# EAGLE design daughterboard (EAGLE 9.6.2)
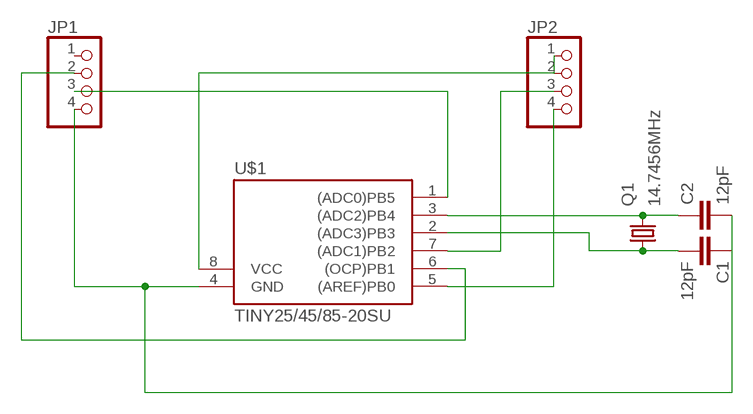
[diagram p0: schematic, sheet 1]

## Parts
C1  12pF  C-EUC0805  [C0805]
C2  12pF  C-EUC0805  [C0805]
JP1  PINHD-1X4  [1X04]
JP2  PINHD-1X4  [1X04]
Q1  14.7456MHz  KX-7  [3.2X2.5_KX-7]
U$1  TINY25/45/85-20SU  [SOIC8]

## Nets
N$1: JP2.1 JP2.2 U$1.8(VCC)
N$2: JP2.3 U$1.7((ADC1)PB2)
N$3: JP2.4 U$1.5((AREF)PB0)
N$4: C1.1 C2.2 JP1.4 U$1.4(GND)
N$5: JP1.3 U$1.1((ADC0)PB5)
N$6: JP1.2 U$1.6((OCP)PB1)
N$7: C2.1 Q1.3 U$1.3((ADC2)PB4)
N$8: C1.2 Q1.1 U$1.2((ADC3)PB3)
Unconnected: JP1.1

## Library data of the parts
C1 C2 = resistor:C-EU: CAPACITOR, European symbol
JP1 JP2 = pinhead:PINHD-1X4: PIN HEADER
Q1 = crystal-geyer_V1_0:KX: Quartz Crystals (MHz) SMD: KX - Serie Model Size l/w/h [mm] Frequency Range Frequency Stability Temp. Range [°C] Load Capacitance AECQ 200 availabel Datasheet KX-4 KX-5 KX-6 KX-7 KX-9A KX-9B KX-12A KX-12B KX-13 KX-20 KX-K KX-KS 1.6/1.2/0.3 2.0/1.6/0.45 2.5/2.0/0.55 3.2/2.5/0.8 5.0/3.2/1.0 5.0/3.2/1.1 6.0/3.5/1.1 6.0/3.5/1.0 7.0/5.0 /1.3 11.6/5.5/1.6 12.3/4.5/4.2 12.3/4.5/3.2 24.0 ~ 80.0 MHz 16.0 ~ 80.0 MHz 12.0 ~ 80.0 MHz 8.0 ~ 60.0 MHz 7,68 ~ 300,0 MHz 8,0 ~ 50,0 MHz 8,0 ~ 150,0 MHz 8,0 ~ 50,0 MHz 6,0 ~ 160,0 MHz 3,579 ~ 25,0 MHz 3,579 ~ 70,0 MHz 3,579 ~ 70,0 MHz ±10 … ±50ppm ±10 … ±50ppm ±10 … ±50ppm ±10 … ±50ppm ±10 … ±50ppm ±10 … ±50ppm ±10 … ±50ppm ±10 … ±50ppm ±10 … ±50ppm ±50ppm ±10 … ±50ppm ±10 … ±50ppm (*) -40°C …+85°C (*) -40°C …+125°C (*) -40°C …+125°C (*) -40°C …+125°C (*) -40°C …+105°C (*) -40°C …+105°C (*) -40°C …+125°C (*) -40°C …+105°C (*) -40°C …+105°C (*) -40°C …+105°C (*) -40°C …+85°C (*) -40°C …+85°C 8, 8…16 8, 8…16 10, 8…16 12, 7…20 16, 10…20 16, 10…20 16, 10…20 16, 12…20 16, 12…20 16, 12…20 16, 12…30 16, 12…30 - yes yes yes - - - - - - - - KX-4.pdf <http://www.geyer-electronic.de/uploads/tx_userartikelfrequenz/GEYER-KX-4.pdf> KX-5.pdf <http://www.geyer-electronic.de/uploads/tx_userartikelfrequenz/GEYER-KX-5.pdf> KX-6.pdf <http://www.geyer-electronic.de/uploads/tx_userartikelfrequenz/GEYER-KX-6.pdf> KX-7.pdf <http://www.geyer-electronic.de/uploads/tx_userartikelfrequenz/GEYER-KX-7.pdf> KX-9A.pdf <http://www.geyer-electronic.de/uploads/tx_userartikelfrequenz/GEYER-KX-9A.pdf> KX-9B.pdf <http://www.geyer-electronic.de/uploads/tx_userartikelfrequenz/GEYER-KX-9B.pdf> KX-12A.pdf <http://www.geyer-electronic.de/uploads/tx_userartikelfrequenz/GEYER-KX-12A.pdf> KX-12B.pdf <http://www.geyer-electronic.de/uploads/tx_userartikelfrequenz/GEYER-KX-12B.pdf> KX-13.pdf <http://www.geyer-electronic.de/uploads/tx_userartikelfrequenz/GEYER-KX-13.pdf> KX-20.pdf <http://www.geyer-electronic.de/uploads/tx_userartikelfrequenz/GEYER-KX-20.pdf> KX-K.pdf <http://www.geyer-electronic.de/uploads/tx_userartikelfrequenz/GEYER-KX-K.pdf> KX-KS.pdf <http://www.geyer-electronic.de/uploads/tx_userartikelfrequenz/GEYER-KX-KS.pdf> <http://www.geyer-electronic.de/fileadmin/template/img/logo-geyer-electronic.png> Details see: http://www.geyer-electronic.de/Frequenz-Produkte.9.0.html Created 2016-06-07, Hans Locher 2016 (C) Geyer Quartz Technology KX4,KX5,KX6,KX7,KX9A,KX9B,KX12A,KX12B,KX13,KX20,KXK,KXKS;1612;2016;2520;3225;5032;6035;7050;11655;12345;1,6x1,2;2,0x1,6;2,5x2,0;3,2x2,5;5,0x3,2;6,0x3,5;7,0x5,0;11,6x5,5;12,3x4,5;12,3x4,5;1.6x1.2;2.0x1.6;2.5x2.0;3.2x2.5;5.0x3.2;6.0x3.5;7.0x5.0;11.6x5.5;12.3x4.5;12.3x4.5;
U$1 = avr-7(1):TINY25/45/85

## Board
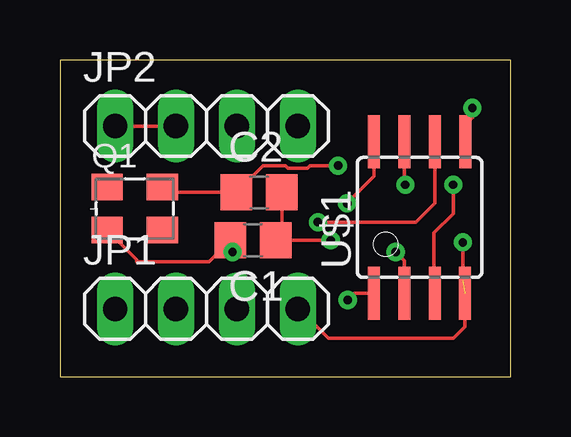
[diagram p1: board, top side]
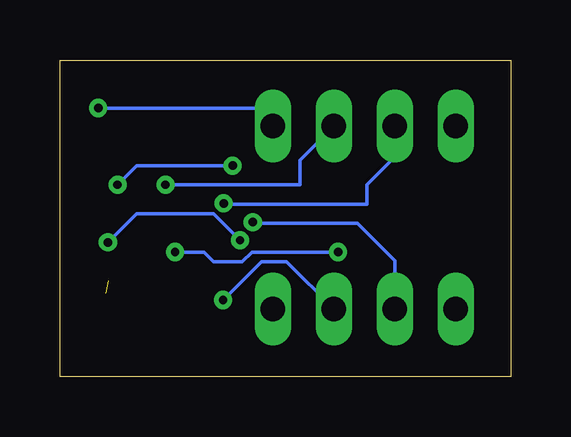
[diagram p2: board, bottom side, seen from below]

Size 18.8 x 13.2 mm. Coordinates in mm from the lower left corner, seen from the top.
Outline: 0,0 18.8,0 18.8,13.2 0,13.2 0,0
Copper layers (1*16): Top 0.035mm / dielectric 1.5mm / Bottom 0.035mm
Design rules "default": minimum track width 6mil, minimum drill 0.35mm, track to track 6mil, track to pad 6mil, pad to pad 6mil, via to via 6mil, smd to smd 6mil, copper to edge 40mil, drill to drill 6mil, minimum pad ring 10mil, minimum via ring 8mil, stop-mask expansion 4mil, vias tented up to drill 0mil, thermal gap 10mil

### Footprints (pad centres in the part's own frame; a part is rotated, then mirrored left to right if it is on the bottom)
C0805 = smd 1.3 x 1.5: 1 -0.95,0; 2 0.95,0
1X04 = drill 1.016 long: 1 -3.81,0; 2 -1.27,0; 3 1.27,0; 4 3.81,0
3.2X2.5_KX-7 = smd 1.3 x 1.1: 1 -1.15,-0.9; 2 1.15,-0.9; 3 1.15,0.9; 4 -1.15,0.9
SOIC8 = smd 0.5 x 2.2: 1 -1.905,-3.154; 2 -0.645,-3.154; 3 0.625,-3.154; 4 1.895,-3.154; 5 1.905,3.154; 6 0.635,3.154; 7 -0.635,3.154; 8 -1.905,3.154

### Placement (x,y rotation side)
C1  8.05,5.69 180 top
C2  8.3,7.68 0 top
JP1  6.11,2.83 0 top
JP2  6.11,10.45 0 top
Q1  3.12,7.01 0 top
U$1  15,6.64 0 top

### Tracks (layer width: path | path; a pad name or v marks a point on that pad's centre or on a via)
N$1  (via drill 0.35)
  Top 0.152: JP2.1 JP2.2 | v11.97,7.23 13.1,8.35 U$1.8
  Bottom 0.152: JP2.2 4.84,9.16 6,8 6,7.2 11.94,7.2 v11.97,7.23
N$2  (via drill 0.35)
  Top 0.152: v14.4,8 14.37,8.04 U$1.7
  Bottom 0.152: JP2.3 8.8,9.03 8.8,8 v14.4,8
N$3  (via drill 0.35)
  Top 0.152: v17.2,11.2 17.2,10.8 16.8,10.4 16.8,9.9 U$1.5
  Bottom 0.152: JP2.4 10.67,11.2 v17.2,11.2
N$4  (via drill 0.35)  (1 unrouted)
  Top 0.152: C2.2 9.25,5.94 C1.1 v11.29,5.69 | v16.8,5.6 16.8,4 | U$1.4 16.89,2.1 16.4,1.6 11.2,1.6 9.97,2.83 JP1.4
  Bottom 0.152: v11.29,5.69 12.4,6.8 15.6,6.8 v16.8,5.6
N$5  (via drill 0.35)
  Top 0.152: v12,3.2 12.29,3.49 U$1.1
  Bottom 0.152: JP1.3 9.35,4.8 10.4,4.8 v12,3.2
N$6  (via drill 0.35)
  Top 0.152: v10.76,6.44 14.84,6.44 15.63,7.24 U$1.6
  Bottom 0.152: JP1.2 4.84,4.84 6.4,6.4 10.8,6.4 v10.76,6.44
N$7  (via drill 0.35)
  Top 0.152: Q1.3 4.5,7.68 C2.1 8.47,8.8 9.41,8.8 9.51,8.7 10.33,8.7 10.43,8.8 v11.6,8.8 | v16.4,8 16.4,6.8 15.6,6 15.6,3.51 U$1.3
  Bottom 0.152: v11.6,8.8 15.6,8.8 v16.4,8
N$8  (via drill 0.35)
  Top 0.152: Q1.1 3.2,4.88 3.2,4.8 6.21,4.8 C1.2 7.2,5.59 v7.2,5.2 | v14,5.2 14.36,4.84 U$1.2
  Bottom 0.152: v7.2,5.2 10.8,5.2 11.2,4.8 12.4,4.8 12.8,5.2 v14,5.2